# EAGLE schematic MegaShieldTrioV2 (EAGLE 7.1.0)
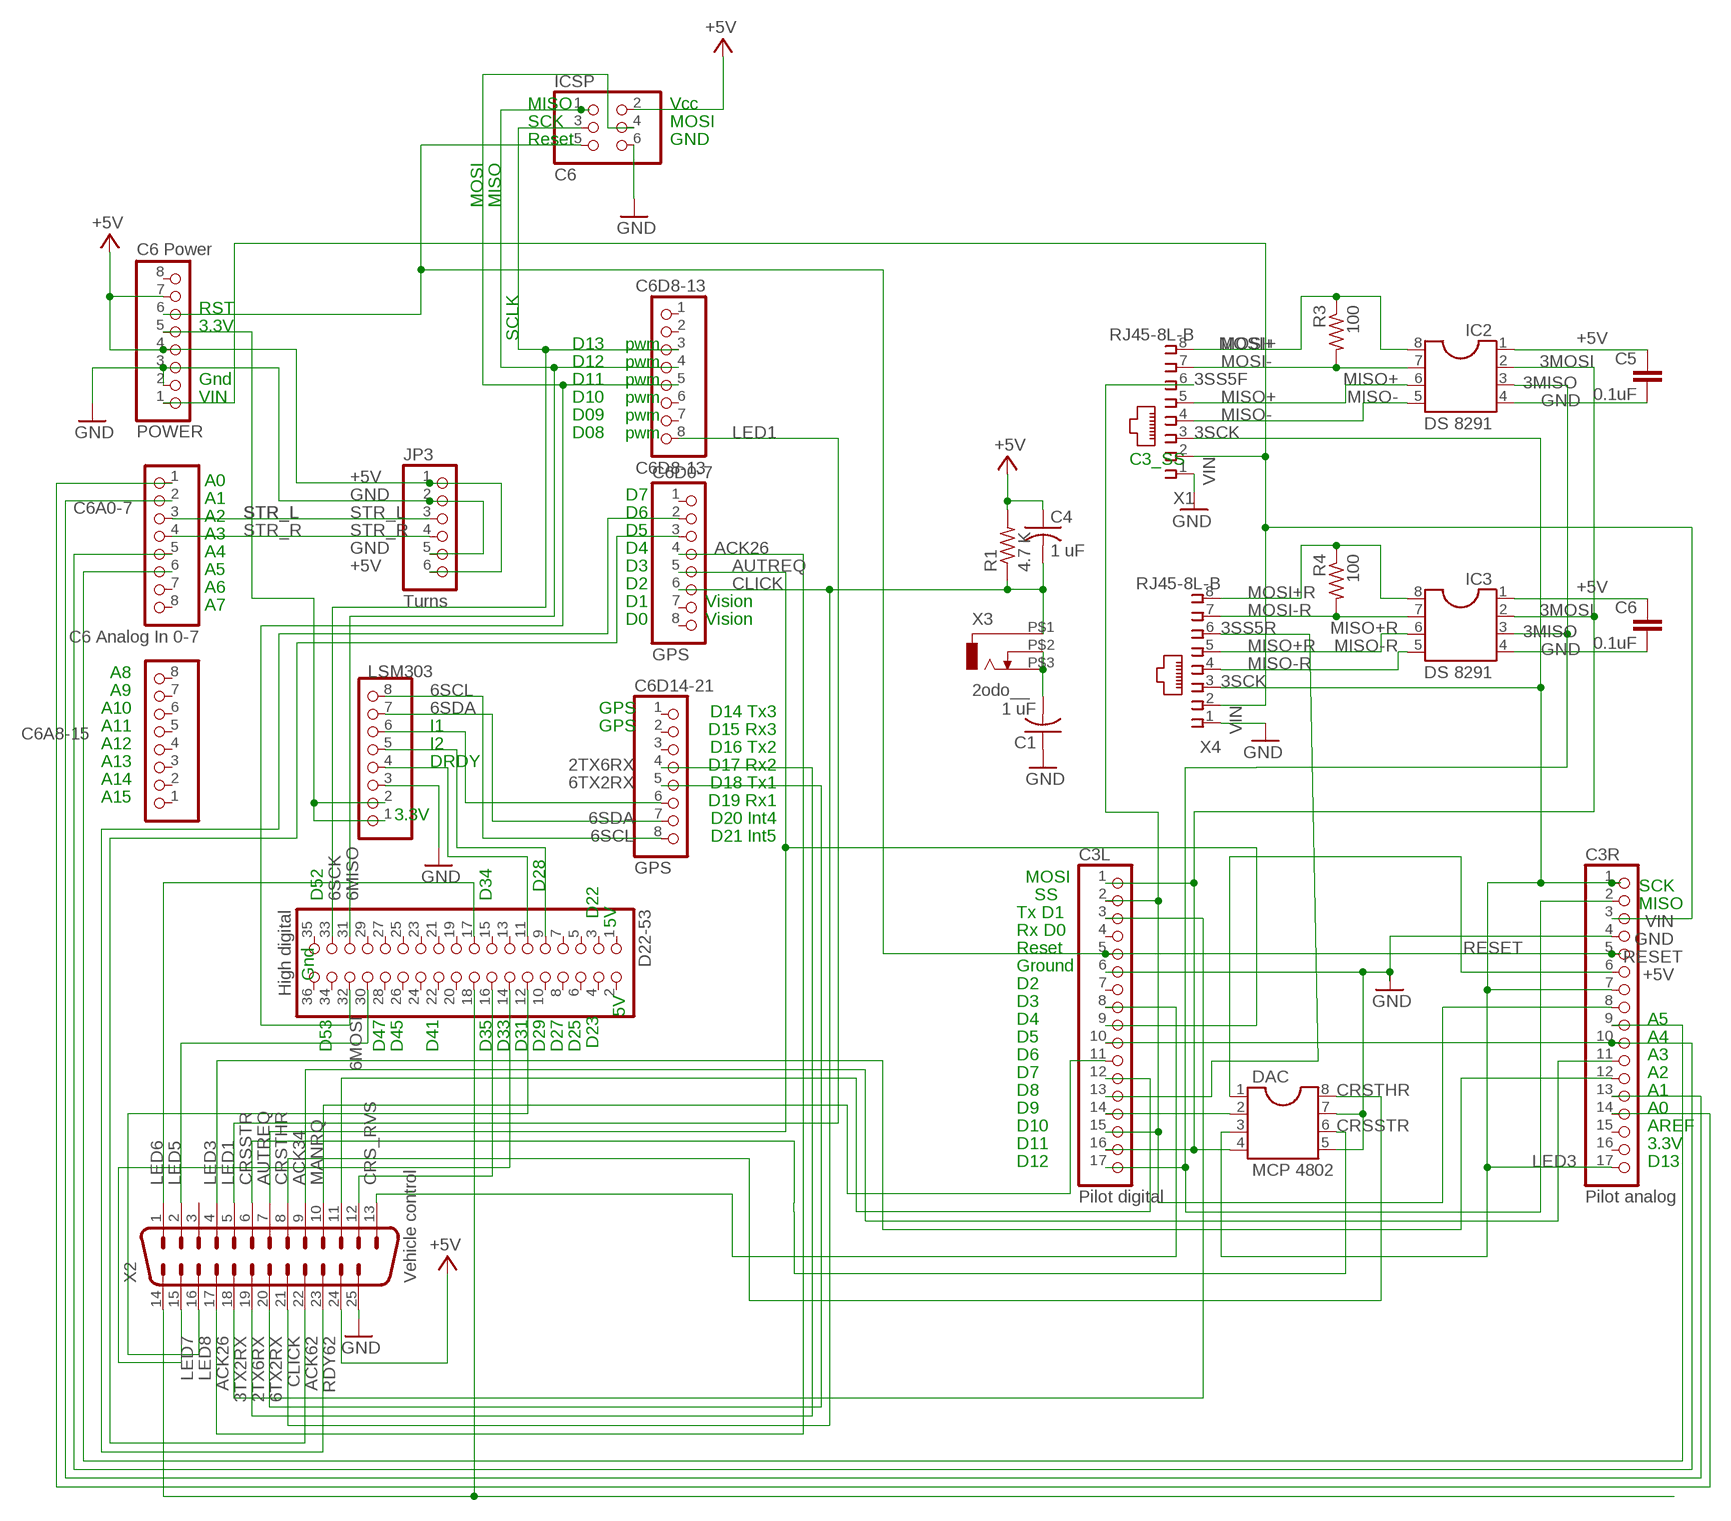
[diagram p0: schematic, sheet 1]

## Parts
C1  1 uF  C-US025-030X050  [C025-030X050]
C3L  Pilot digital  PINHD-1X17  [1X17]
C3R  Pilot analog  PINHD-1X17  [1X17]
C4  1 uF  C-US025-030X050  [C025-030X050]
C5  0.1uF  C2.5/2  [C2.5-2]
C6  0.1uF  C2.5/2  [C2.5-2]
C6A0-7  C6 Analog In 0-7  PINHD-1X8  [1X08]
C6A8-15  PINHD-1X8  [1X08]
C6D0-7  GPS  PINHD-1X8  [1X08]
C6D8-13  C6D8-13  PINHD-1X8  [1X08]
C6D14-21  GPS  PINHD-1X8  [1X08]
D22-53  High digital  PINHD-2X18  [2X18]
DAC  MCP 4802  DIL8  [DIL08]
IC2  DS 8291  DIL8  [DIL08]
IC3  DS 8291  DIL8  [DIL08]
ICSP  C6  PINHD-2X3  [2X03]
JP3  Turns  PINHD-1X6  [1X06]
LSM303  PINHD-1X8  [1X08]
POWER  C6 Power  PINHD-1X8  [1X08]
R1  4.7 K  R-US_0207/10  [0207/10]
R3  100  R-US_0204/5  [0204/5]
R4  100  R-US_0204/5  [0204/5]
X1  RJ45-8L-B  [RJ45-NO-SHIELD]
X2  Vehicle control  M25H  [M25H]
X3  2odo__  ODO_JACK  [ODO_JACK]
X4  RJ45-8L-B  [RJ45-NO-SHIELD]

## Nets
2TX6RX: C6D14-21.4 X2.19
3MISO: C3L.17 C3R.2 IC2.3 IC3.3
3MOSI: C3L.1 C3L.16 DAC.4 IC2.2 IC3.2
3SCK: C3R.1 C3R.7 C3R.17 DAC.3 X1.3 X4.3
3SS5F: C3L.2 C3L.15 C3R.8 X1.6
3SS5R: C3L.13 X4.6
3SS_DAC: C3L.14 DAC.2
3TX2RX: C3L.3 X2.18
3V3: LSM303.1 LSM303.2 POWER.5
5V_C3: C3R.6 DAC.1
6MISO: C6D8-13.4 D22-53.31 ICSP.1
6MOSI: C6D8-13.5 D22-53.32 ICSP.4
6SCK: C6D8-13.3 D22-53.33 ICSP.3
6SCL: C6D14-21.8 LSM303.8
6SDA: C6D14-21.7 LSM303.7
6TX2RX: C6D14-21.5 X2.20
+5V: C4.1 C5.1 C6.1 IC2.1 IC3.1 ICSP.2 JP3.1 JP3.6 POWER.4 POWER.7 R1.2 X2.24
A0: C3R.14 C6A0-7.1
A1: C3R.13 C6A0-7.2
A5: C3R.9 C6A0-7.6
ACK26: C6D0-7.4 X2.17
ACK34: C3R.11 X2.9
ACK43: C3L.10 C3R.10 C6A0-7.5
ACK62: C6D0-7.3 X2.22
AUTREQ: C3L.9 C6D0-7.5 X2.7
CLICK: C4.2 C6D0-7.6 R1.1 X2.21 X3.P$1
CRS_RVS: C3L.8 X2.13
CRSSTR: DAC.6 X2.6
CRSTHR: DAC.8 X2.8
D09: D22-53.18 X2.14
DRDY: D22-53.11 LSM303.4
GND: C1.1 C3L.6 C3R.4 C5.2 C6.2 DAC.5 DAC.7 IC2.4 IC3.4 ICSP.6 JP3.2 JP3.5 LSM303.3 POWER.2 POWER.3 X1.1 X2.25 X4.1
I1LSM: C6D14-21.6 LSM303.6
I2LSM: D22-53.9 LSM303.5
LED1: C6D8-13.8 X2.5
LED3: C3R.12 X2.4
LED5: D22-53.30 X2.2
LED6: D22-53.17 X2.1
LED7: D22-53.14 X2.15
LED8: D22-53.12 X2.16
MANRQ: C3L.11 X2.10
MISO+: IC2.6 X1.5
MISO+R: IC3.6 X4.5
MISO-: IC2.5 X1.4
MISO-R: IC3.5 X4.4
MOSI+: IC2.8 R3.1 X1.8
MOSI+R: IC3.8 R4.1 X4.8
MOSI-: IC2.7 R3.2 X1.7
MOSI-R: IC3.7 R4.2 X4.7
N$23: C1.2 X3.P$2 X3.P$3
RDY26: D22-53.16 X2.12
RDY32: C3L.12 X2.11
RDY62: C6D0-7.2 X2.23
RESET: C3L.5 C3R.5 ICSP.5 POWER.6
STR_L: C6A0-7.3 JP3.3
STR_R: C6A0-7.4 JP3.4
VIN: C3R.3 POWER.1 X1.2 X4.2
Unconnected: C3L.4 C3L.7 C3R.15 C3R.16 C6A0-7.7 C6A0-7.8 C6A8-15.1 C6A8-15.2 C6A8-15.3 C6A8-15.4 C6A8-15.5 C6A8-15.6 C6A8-15.7 C6A8-15.8 C6D0-7.1 C6D0-7.7 C6D0-7.8 C6D8-13.1 C6D8-13.2 C6D8-13.6 C6D8-13.7 C6D14-21.1 C6D14-21.2 C6D14-21.3 D22-53.1 D22-53.2 D22-53.3 D22-53.4 D22-53.5 D22-53.6 D22-53.7 D22-53.8 D22-53.10 D22-53.13 D22-53.15 D22-53.19 D22-53.20 D22-53.21 D22-53.22 D22-53.23 D22-53.24 D22-53.25 D22-53.26 D22-53.27 D22-53.28 D22-53.29 D22-53.34 D22-53.35 D22-53.36 POWER.8 X2.3

## Notes on the sheet
- MISO | Vcc
- SCK | MOSI
- Reset | GND
- MOSI | MISO
- RST
- 3.3V
- SCLK
- D13 | pwm
- D12 | pwm
- Gnd | D11 | pwm
- VIN | D10 | pwm
- D09 | pwm
- D08 | pwm
- C3_SS
- A0
- A1
- D7
- A2
- D6
- A3
- D5
- A4
- D4
- A5
- D3
- A6
- D2
- A7
- D1 | Vision
- D0 | Vision
- A8
- A9
- D14 Tx3
- A10 | GPS
- D15 Rx3
- A11 | I1 | GPS
- D16 Tx2
- A12 | I2
- D17 Rx2
- A13 | DRDY
- D18 Tx1
- A14
- D19 Rx1
- A15
- D20 Int4
- 3.3V
- D21 Int5
- MOSI
- D28 | SCK
- D52 | D34 | SS
- MISO
- D22 | Tx D1
- 5V
- Rx D0
- Reset
- Ground
- Gnd
- D2
- D3
- D23 | 5V
- D4 | A5
- D5 | A4
- D53 | D47 | D45 | D41 | D35 | D33 | D31 | D29 | D27 | D25
- D6 | A3
- D7 | A2
- D8 | A1
- D9 | A0
- D10 | AREF
- D11 | 3.3V
- D12 | D13

## Library data of the parts
C1 C4 = rcl:C-US: CAPACITOR, American symbol
C3L C3R = pinhead:PINHD-1X17: PIN HEADER
C5 C6 = capacitor-wima:C: CAPACITOR naming: grid - package width
C6A0-7 C6A8-15 C6D0-7 C6D8-13 C6D14-21 LSM303 POWER = pinhead:PINHD-1X8: PIN HEADER
D22-53 = pinhead:PINHD-2X18: PIN HEADER
DAC IC2 IC3 = ic-package:DIL8: Dual In Line / Socket
ICSP = pinhead:PINHD-2X3: PIN HEADER
JP3 = pinhead:PINHD-1X6: PIN HEADER
R1 = rcl:R-US_: RESISTOR, American symbol
R3 R4 = resistor:R-US_: RESISTOR, American symbol
X1 X4 = con-tycoelectronics:RJ45: CORCOM Modular RJ Jacks No Shield Source: www.tycoelectronics.com .. ENG_DS_1654001_1099_RJ_L_0507.pdf; MF: TYCO ELECTRONICS; MPN: RJ45-8L-B; OC_FARNELL: 1279843; OC_NEWARK: 52K4445
X2 = con-subd:M25: SUB-D; OC_FARNELL: unknown; OC_NEWARK: unknown
X3 = Elcano:ODO_JACK

## Net classes
0 default: width 0.152 mm, drill 0.305 mm, clearance 0.152 mm